# EasyEDA Pro project f4_sys_2025-04-04_13-30-10.eprj

# Schematic Schematic1
Board Name: Board1; Create Date: 2025-04-04; Page Name: P1; Project Name: f4_sys_2025-04-04_13-30-10; Schematic Name: Schematic1; Update Date: 2025-04-20; Company: 嘉立创EDA; Page Size: A4; Version: V1.0
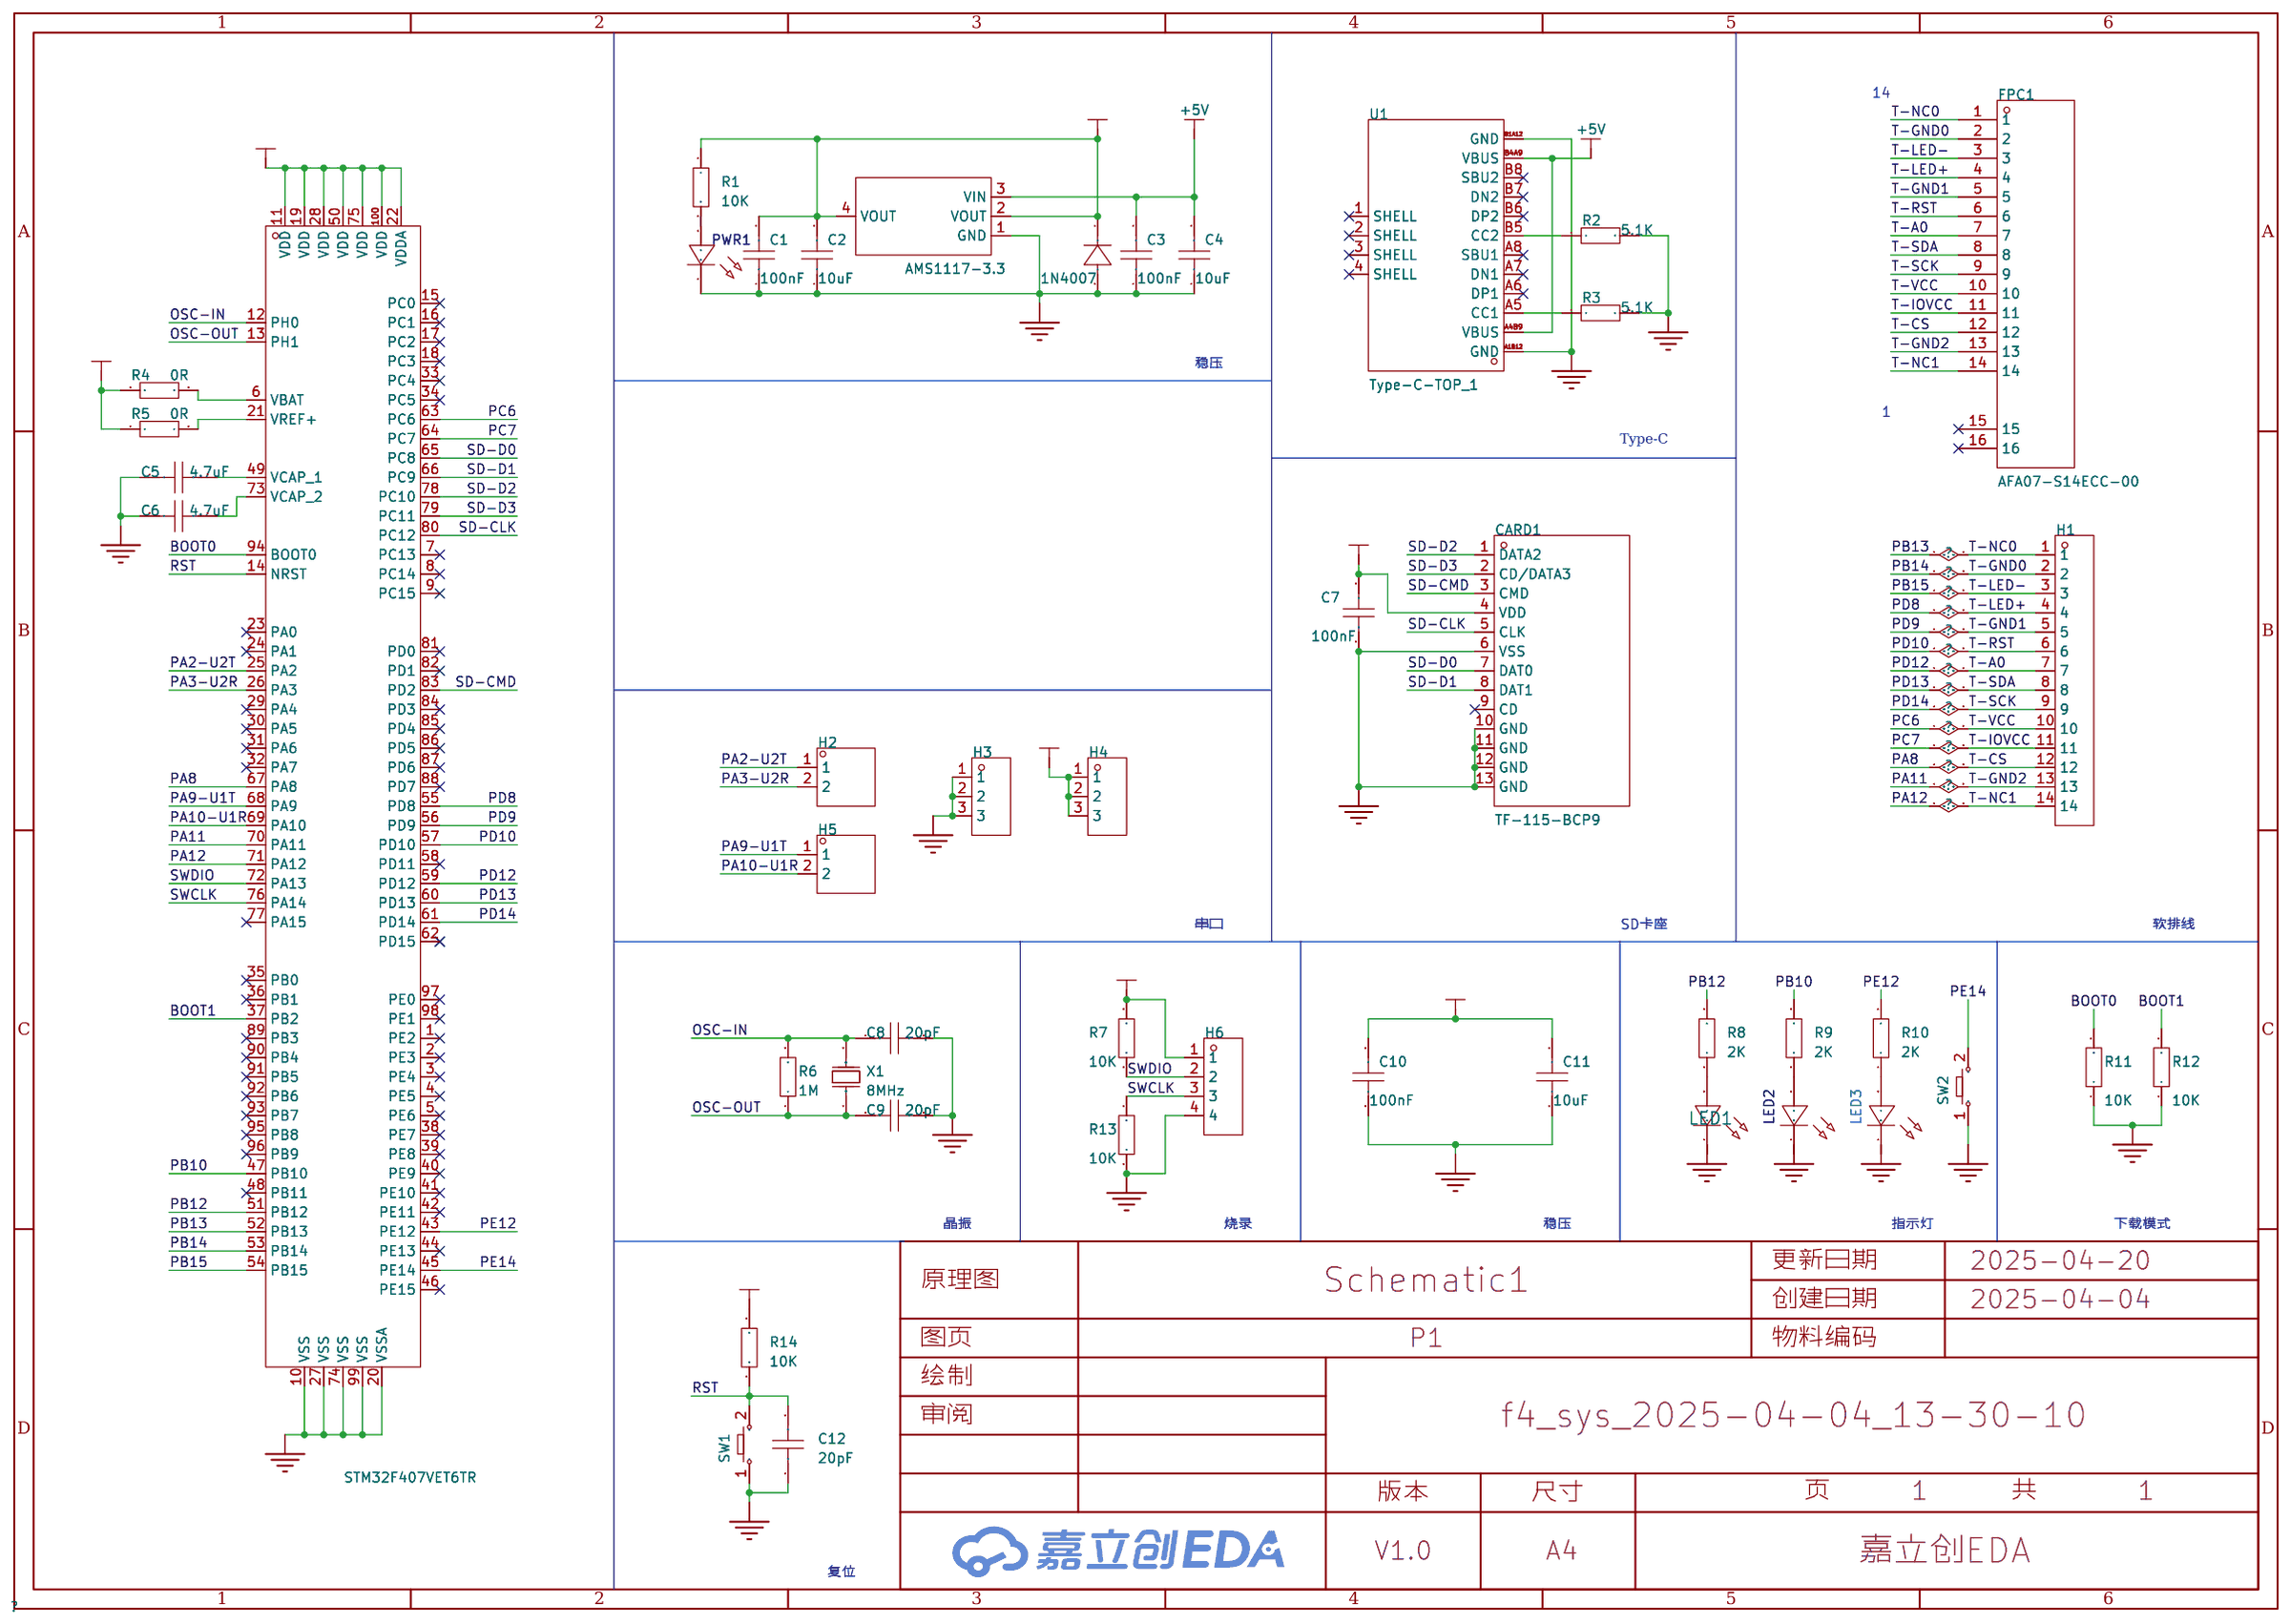
[diagram p0: schematic sheet]

## Parts
C1  100nF  [C0805]
C2  10uF  [C0805]
C3  100nF  [C0805]
C4  10uF  [C0805]
C5  4.7uF  [C0805]
C6  4.7uF  [C0805]
C7  100nF  [C0805]
C8  20pF  [C0805]
C9  20pF  [C0805]
C10  100nF  [C0805]
C11  10uF  [C0805]
C12  20pF  [C0805]
CARD1  TF-115-BCP9  [TF-SMD_TF-115-BCP9]
FPC1  AFA07-S14ECC-00  [FPC-SMD_AFA07-S14ECC-00]
H1  -  [HDR-TH_14P-P2.54-V-M]
H2  -  [HDR-TH_2P-P2.54-V-M-1]
H3  -  [HDR-TH_3P-P2.54-V-M]
H4  -  [HDR-TH_3P-P2.54-V-M]
H5  -  [HDR-TH_2P-P2.54-V-M-1]
H6  -  [HDR-TH_4P-P2.54-V-M]
LED1  -  [LED_0805]
LED2  -  [LED_0805]
LED3  -  [LED_0805]
PWR1  -  [LED_0805]
R1  10K  [R0805]
R2  5.1K  [R0805]
R3  5.1K  [R0805]
R4  0R  [R0805]
R5  0R  [R0805]
R6  1M  [R0805]
R7  10K  [R0805]
R8  2K  [R0805]
R9  2K  [R0805]
R10  2K  [R0805]
R11  10K  [R0805]
R12  10K  [R0805]
R13  10K  [R0805]
R14  10K  [R0805]
SW1  -  [Key_SMD_3x4x2]
SW2  -  [Key_SMD_3x4x2]
U1  Type-C-TOP_1  [USB-C-SMD_TYPE-C16PIN]
U2  AMS1117-3.3  [SOT-223-3_L6.5-W3.4-P2.30-LS7.0-BR]
U3  STM32F407VET6TR  [LQFP-100_L14.0-W14.0-P0.50-LS16.0-BL]
U4  1N4007  [SMA_L4.3-W2.6-LS5.1-RD]
X1  8MHz  [HC-49S_L11.5-W4.8]

## Library data of the parts
C1-C12 = CAP_0805: Supplier Footprint: 0805
CARD1 = TF-115-BCP9: LCSC Part Name: 自弹式 MicroSD卡(TF卡) 卡座; Supplier Part: C720505; Manufacturer: XUNPU(讯普); Supplier Footprint: SMD; JLCPCB Part Class: 扩展库; Datasheet: https://atta.szlcsc.com/upload/public/pdf/source/20210906/DBEC8F03AA1503572333C7CF4A76D0AD.pdf; Supplier: LCSC; Card Connection Mode: 自弹式; Card Type: MicroSD卡(TF卡); Connector Type: 卡座; Maximum Body Height: 1.8mm; Operating Temperature Range: -25℃~+85℃
FPC1 = AFA07-S14ECC-00: LCSC Part Name: 间距:1mm P数:14P 抽屉式 上接; Supplier Part: C262369; Manufacturer: JS(钜硕电子); Supplier Footprint: SMD,P=1mm,卧贴; JLCPCB Part Class: 扩展库; Datasheet: https://atta.szlcsc.com/upload/public/pdf/source/20180810/C262751_01D74A74D4351CFF8B7B7891E98822FA.pdf; Supplier: LCSC; Locking Feature: 抽屉式; Contact Type: 上接; Number of Contacts: 14P; Pitch: 1mm; Mounting Type: 卧贴; FFC, FCB Thickness: 0.3mm; Height Above Board: 2.5mm
H1 = HDR-M_2.54_1x14P: Supplier Part: C2894937; Supplier Footprint: 插件
H2 H5 = HDR-M_2.54_1x2P: Supplier Part: C124375; Supplier Footprint: 插件
H3 H4 = HDR-M_2.54_1x3P: Supplier Part: C2937625; Supplier Footprint: 插件
H6 = HDR-M_2.54_1x4P: Supplier Part: C492403; Supplier Footprint: 插件
LED1 = LED_0805-R: Supplier Footprint: 0805
LED2 PWR1 = LED_0805-G: Supplier Footprint: 0805
LED3 = LED_0805-B: Supplier Footprint: 0805
R1-R14 = Res_0805: Supplier Footprint: 0805
SW1 SW2 = Key_SMD_3x4x2: Supplier Footprint: SMD
U1 = Type-C-TOP_1: Supplier Part: C9900005857; Supplier Footprint: Type-C16P; JLCPCB Part Class: 扩展库; Supplier: LCSC
U2 = AMS1117-3.3_C6186: LCSC Part Name: 输出3.3V 1A; Supplier Part: C6186; Manufacturer: AMS; Supplier Footprint: SOT-223; JLCPCB Part Class: 基础库; Datasheet: https://atta.szlcsc.com/upload/public/pdf/source/20180727/C6186_7A095716F0823C02F1997A905E26C086.pdf; Supplier: LCSC; Output Type: 固定; Output Voltage: 3.3V; Output Current: 1A; Power Supply Rejection Ratio (PSRR): 72dB@(120Hz); Voltage Dropout: 1.3V@(800mA); Features: 过流保护(OCP)；热关断(TSD); Output Configuration: 正极; Number of Outputs: 1
U3 = STM32F407VET6TR: LCSC Part Name: 带DSP和FPU的高性能基础系列ARM Cortex-M4 MCU，具有512 KB Flash、168 MHz CPU、ART加速器、以太网和FSMC; Supplier Part: C5269943; Manufacturer: ST(意法半导体); Supplier Footprint: LQFP-100(14x14); JLCPCB Part Class: 扩展库; Datasheet: https://atta.szlcsc.com/upload/public/pdf/source/20201130/C919362_39400D478C258148B3DF984CE4A4041A.pdf; Supplier: LCSC; CPU Core: ARM-M4; CPU Maximum Speed: 168MHz; Number of I/O: 82; ADC (Bit): 12bit; DAC (Bit): 12bit; Low Voltage Detection Threshold: 1.8V~3.6V
U4 = 1N4007: Supplier Part: C9900004759; JLCPCB Part Class: 扩展库; Supplier: LCSC
X1 = 49SAT080000201060: LCSC Part Name: 8MHz ±10ppm 20pF; Supplier Part: C390758; Manufacturer: JGHC(晶光华); Supplier Footprint: HC-49S-SMD; JLCPCB Part Class: 扩展库; Datasheet: https://atta.szlcsc.com/upload/public/pdf/source/20200102/C479159_77354EAC8C21D1127CB2E163DDA33705.pdf; Supplier: LCSC; Crystal Type: 贴片晶振; Normal temperature Frequency Tolerance: ±10ppm; External load capacitor: 20pF; Operating Temperature: -20℃~+70℃

## Nets
+3.3V: C1.2 C2.2 C7.2 C10.2 C11.2 CARD1.4(VDD) H4.1 H4.2 H4.3 H6.1 R1.1 R4.1 R5.1 R7.2 R14.2 U2.2(VOUT) U2.4(VOUT) U3.11(VDD) U3.19(VDD) U3.22(VDDA) U3.28(VDD) U3.50(VDD) U3.75(VDD) U3.100(VDD) U4.1(K)
+5V: C3.2 C4.2 U1.A4B9(VBUS) U1.B4A9(VBUS) U2.3(VIN)
GND: C1.1 C2.1 C3.1 C4.1 C5.1 C6.1 C7.1 C8.2 C9.2 C10.1 C11.1 C12.1 CARD1.6(VSS) CARD1.10(GND) CARD1.11(GND) CARD1.12(GND) CARD1.13(GND) H3.1 H3.2 H3.3 H6.4 LED1.1(C) LED2.1(C) LED3.1(C) PWR1.1(C) R2.2 R3.2 R11.1 R12.1 R13.1 SW1.1 SW2.1 U1.A1B12(GND) U1.B1A12(GND) U2.1(GND) U3.10(VSS) U3.20(VSSA) U3.27(VSS) U3.74(VSS) U3.99(VSS) U4.2(A)
BOOT0: R11.2 U3.94(BOOT0)
BOOT1: R12.2 U3.37(PB2)
OSC-IN: C8.1 R6.2 U3.12(PH0) X1.2(OSC2)
OSC-OUT: C9.1 R6.1 U3.13(PH1) X1.1(OSC1)
PA2-U2T: H2.1 U3.25(PA2)
PA3-U2R: H2.2 U3.26(PA3)
PA8: FPC1.12 H1.12 U3.67(PA8)
PA9-U1T: H5.1 U3.68(PA9)
PA10-U1R: H5.2 U3.69(PA10)
PA11: FPC1.13 H1.13 U3.70(PA11)
PA12: FPC1.14 H1.14 U3.71(PA12)
PB10: R9.2 U3.47(PB10)
PB12: R8.2 U3.51(PB12)
PB13: FPC1.1 H1.1 U3.52(PB13)
PB14: FPC1.2 H1.2 U3.53(PB14)
PB15: FPC1.3 H1.3 U3.54(PB15)
PC6: FPC1.10 H1.10 U3.63(PC6)
PC7: FPC1.11 H1.11 U3.64(PC7)
PD8: FPC1.4 H1.4 U3.55(PD8)
PD9: FPC1.5 H1.5 U3.56(PD9)
PD10: FPC1.6 H1.6 U3.57(PD10)
PD12: FPC1.7 H1.7 U3.59(PD12)
PD13: FPC1.8 H1.8 U3.60(PD13)
PD14: FPC1.9 H1.9 U3.61(PD14)
PE12: R10.2 U3.43(PE12)
PE14: SW2.2 U3.45(PE14)
RST: C12.2 R14.1 SW1.2 U3.14(NRST)
SD-CLK: CARD1.5(CLK) U3.80(PC12)
SD-CMD: CARD1.3(CMD) U3.83(PD2)
SD-D0: CARD1.7(DAT0) U3.65(PC8)
SD-D1: CARD1.8(DAT1) U3.66(PC9)
SD-D2: CARD1.1(DATA2) U3.78(PC10)
SD-D3: CARD1.2(CD/DATA3) U3.79(PC11)
SWCLK: H6.3 R13.2 U3.76(PA14)
SWDIO: H6.2 R7.1 U3.72(PA13)
$1N2490: C5.2 U3.49(VCAP_1)
$1N2542: C6.2 U3.73(VCAP_2)
$1N5030: PWR1.2(A) R1.2
$1N7226: R2.1 U1.B5(CC2)
$1N7230: R3.1 U1.A5(CC1)
$1N11588: R4.2 U3.6(VBAT)
$1N11629: R5.2 U3.21(VREF+)
Net-(LED1-2): LED1.2(A) R8.1
Net-(LED2-2): LED2.2(A) R9.1
Net-(LED3-2): LED3.2(A) R10.1

Not connected (* = marked no-connect by the designer): CARD1 9(CD)*; FPC1 15* 16*; U1 1(SHELL)* 2(SHELL)* 3(SHELL)* 4(SHELL)* A6(DP1)* A7(DN1)* A8(SBU1)* B6(DP2)* B7(DN2)* B8(SBU2)*; U3 1(PE2)* 2(PE3)* 3(PE4)* 4(PE5)* 5(PE6)* 7(PC13)* 8(PC14)* 9(PC15)* 15(PC0)* 16(PC1)* 17(PC2)* 18(PC3)* 23(PA0)* 24(PA1)* 29(PA4)* 30(PA5)* 31(PA6)* 32(PA7)* 33(PC4)* 34(PC5)* 35(PB0)* 36(PB1)* 38(PE7)* 39(PE8)* 40(PE9)* 41(PE10)* 42(PE11)* 44(PE13)* 46(PE15)* 48(PB11)* 58(PD11)* 62(PD15)* 77(PA15)* 81(PD0)* 82(PD1)* 84(PD3)* 85(PD4)* 86(PD5)* 87(PD6)* 88(PD7)* 89(PB3)* 90(PB4)* 91(PB5)* 92(PB6)* 93(PB7)* 95(PB8)* 96(PB9)* 97(PE0)* 98(PE1)*

## Notes on the sheet
- 14
- 稳压
- 1
- Type-C
- 串口
- SD卡座
- 软排线
- 晶振
- 烧录
- 稳压
- 指示灯
- 下载模式
- 复位

# Board PCB1
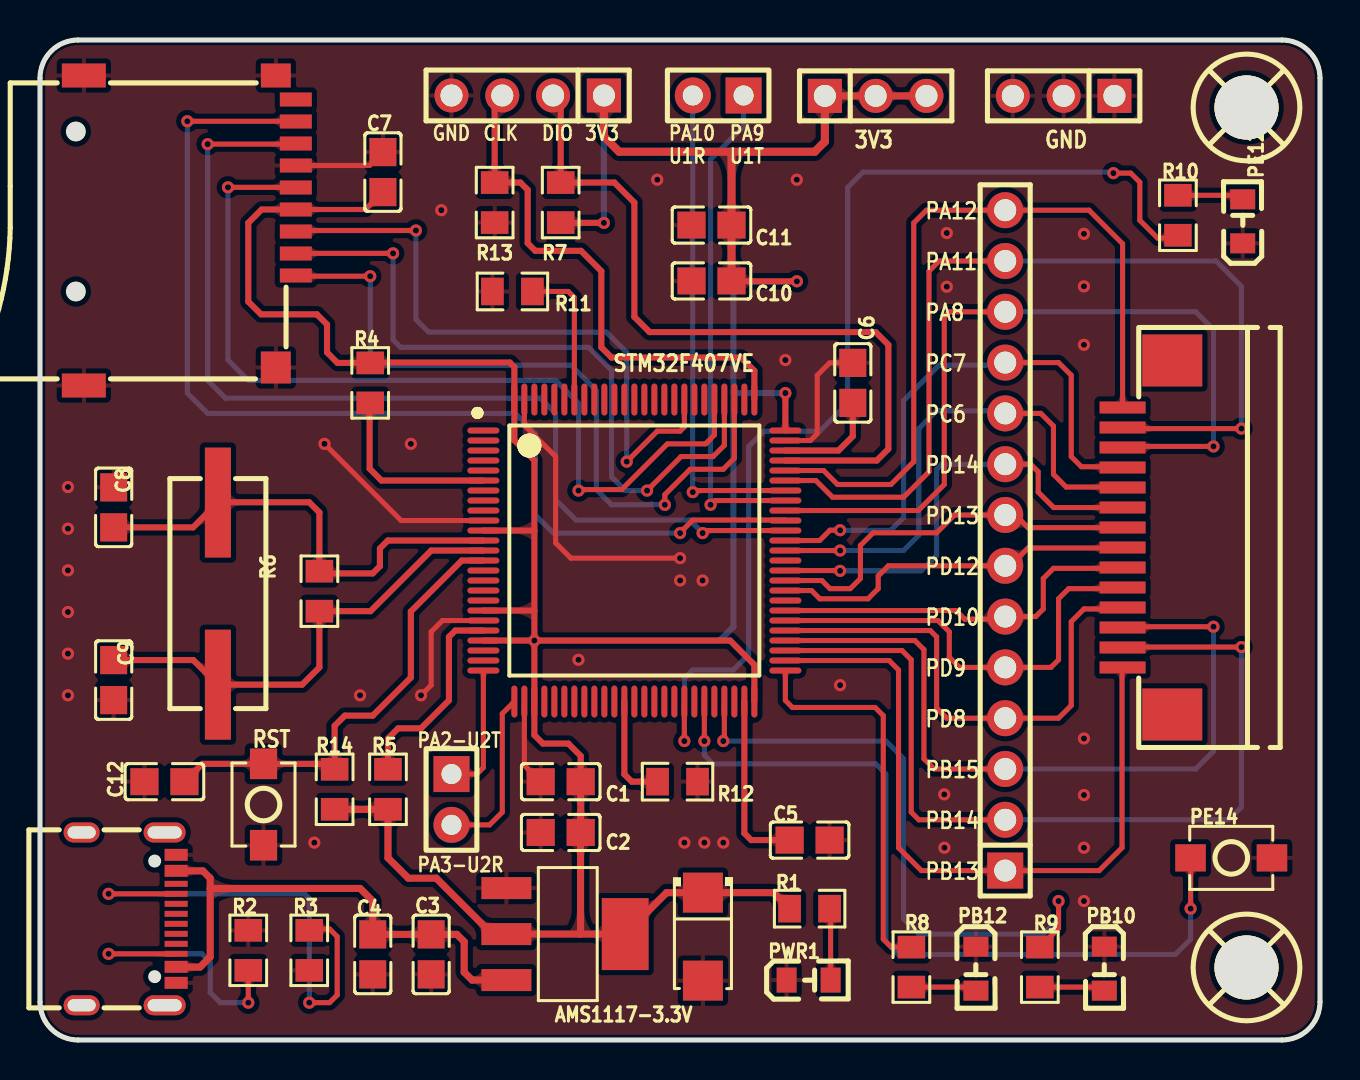
[diagram p1: board, top side]
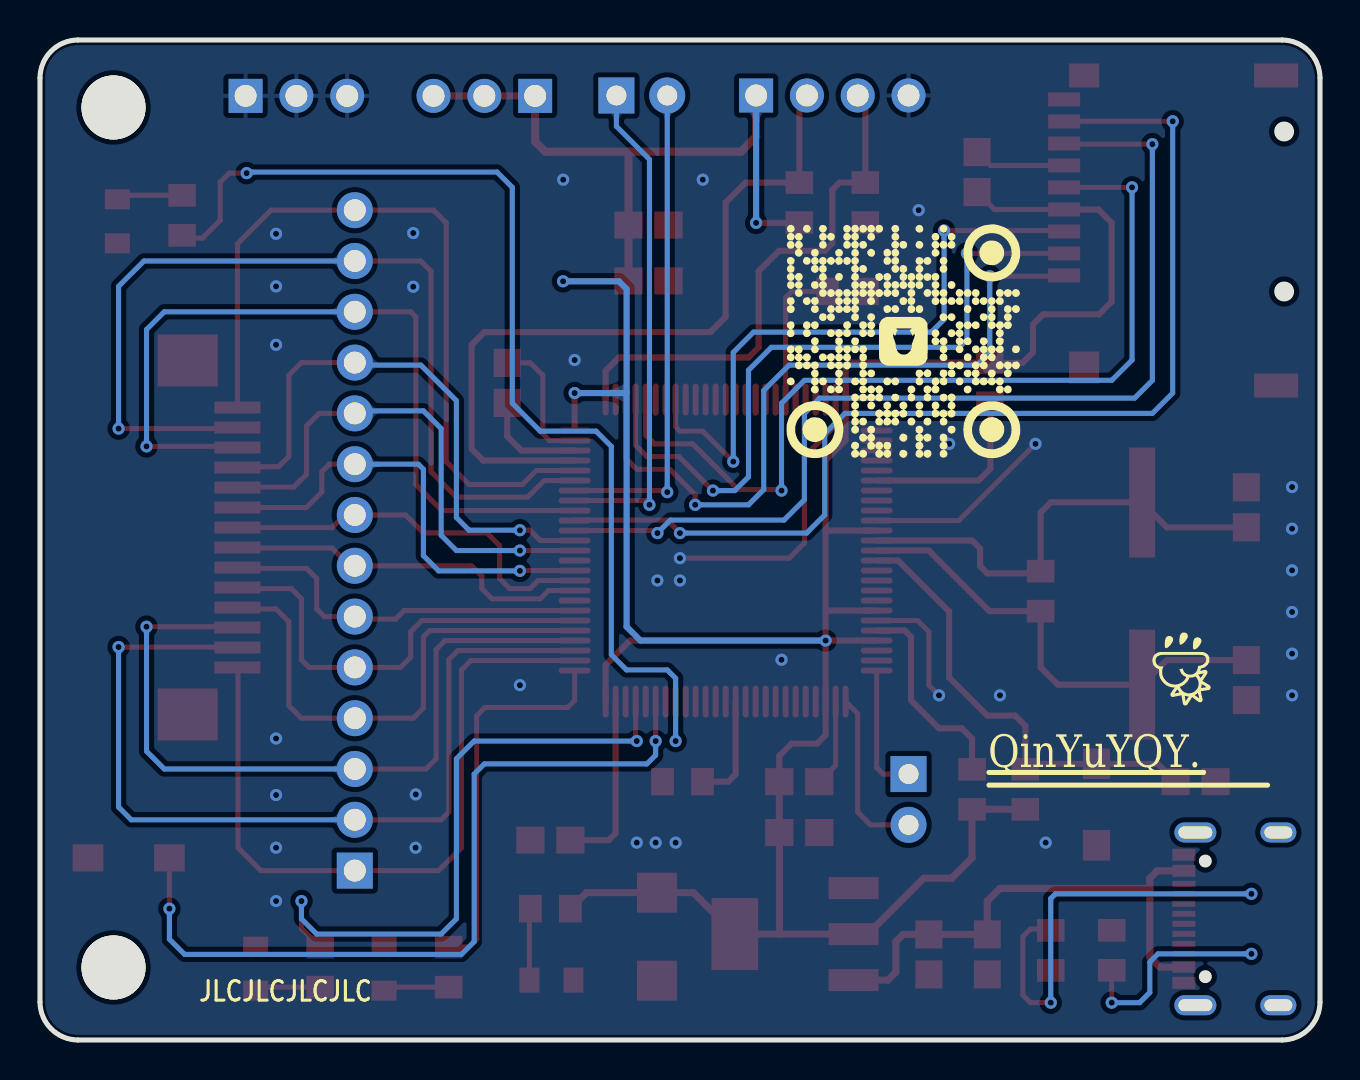
[diagram p2: board, bottom side, seen from below]

Outline 64 x 50 mm; copper layers: Top Layer, Bottom Layer. Coordinates in mm from the lower left corner of the outline.
Outline path: 0,48.1 0,1.91 arc(0.56,0.56) 1.91,0 62.09,0 arc(63.44,0.56) 64,1.91 64,48.1 arc(63.44,49.44) 62.09,50 1.91,50 arc(0.56,49.44) 0,48.1
Stack: Top Layer 0.035mm / Dielectric1 1.51mm FR4 er 4.5 / Bottom Layer 0.035mm

## Design rules (mm)
net OSC-IN: DP1
net OSC-OUT: DP1
template: 自定义配置
spacing copperThickness1oz (default): track to track 0.102, other pairs 0.102 to 0.3
spacing copperThickness2oz: track to track 0.203, other pairs 0.152 to 0.3
track width copperThickness1oz (default): min 0.127, default 0.254, max 2.54
track width copperThickness2oz: min 0.203, default 0.254, max 2.54
differential pair differentialPair (default): width min 0.127, default 0.254, max 2.54; gap min 0.152, default 0.152
via viaSize (default): diameter min 0.5, default 0.61, max 10; hole min 0.3, default 0.305, max 6.299

## Placement (name value [footprint] x y rotation side)
C1  100nF  [C0805]  26.03 12.92 0 top
C2  10uF  [C0805]  26.03 10.38 0 top
C3  100nF  [C0805]  19.56 4.28 90 top
C4  10uF  [C0805]  16.64 4.28 90 top
C5  4.7uF  [C0805]  38.48 10 180 top
C6  4.7uF  [C0805]  40.64 32.86 270 top
C7  100nF  [C0805]  17.15 43.4 270 top
C8  20pF  [C0805]  3.68 26.63 90 top
C9  20pF  [C0805]  3.68 18 270 top
C10  100nF  [C0805]  33.58 40.75 0 top
C11  10uF  [C0805]  33.58 37.95 0 top
C12  20pF  [C0805]  6.22 12.92 0 top
CARD1  TF-115-BCP9  [TF-SMD_TF-115-BCP9]  7.49 40.48 270 top
FPC1  AFA07-S14ECC-00  [FPC-SMD_AFA07-S14ECC-00]  55.37 25.13 90 top
H1  -  [HDR-TH_14P-P2.54-V-M]  48.26 24.98 90 top
H2  -  [HDR-TH_2P-P2.54-V-M-1]  20.57 12.03 270 top
H3  -  [HDR-TH_3P-P2.54-V-M]  51.18 47.21 180 top
H4  -  [HDR-TH_3P-P2.54-V-M]  41.78 47.21 0 top
H5  -  [HDR-TH_2P-P2.54-V-M-1]  33.91 47.23 180 top
H6  -  [HDR-TH_4P-P2.54-V-M]  24.38 47.23 180 top
PB10  -  [LED_0805]  53.21 3.52 270 top
PB12  -  [LED_0805]  46.79 3.52 270 top
PE12  -  [LED_0805]  60.14 40.98 90 top
PE14  -  [Key_SMD_3x4x2]  59.56 9.11 180 top
PWR1  -  [LED_0805]  38.48 2.99 0 top
R1  10K  [R0805]  38.48 6.57 0 top
R2  5.1K  [R0805]  10.41 4.48 90 top
R3  5.1K  [R0805]  13.46 4.48 270 top
R4  0R  [R0805]  16.51 32.86 270 top
R5  0R  [R0805]  17.4 12.54 90 top
R6  1M  [R0805]  13.97 22.44 90 top
R7  10K  [R0805]  26.03 41.87 270 top
R8  2K  [R0805]  43.57 3.65 90 top
R9  2K  [R0805]  49.99 3.65 90 top
R10  2K  [R0805]  56.9 41.24 270 top
R11  10K  [R0805]  23.62 37.43 0 top
R12  10K  [R0805]  31.88 12.92 180 top
R13  10K  [R0805]  22.73 41.87 90 top
R14  10K  [R0805]  14.73 12.54 270 top
SCREW1  -  [M3螺丝]  60.32 46.63 0 top
SCREW1#2  -  [M3螺丝]  60.32 3.63 0 top
SW1  -  [Key_SMD_3x4x2]  11.18 11.77 90 top
U1  Type-C-TOP_1  [USB-C-SMD_TYPE-C16PIN]  4.44 6.06 270 top
U2  AMS1117-3.3  [SOT-223-3_L6.5-W3.4-P2.30-LS7.0-BR]  26.29 5.3 180 top
U3  STM32F407VET6TR  [LQFP-100_L14.0-W14.0-P0.50-LS16.0-BL]  29.72 24.47 270 top
U4  1N4007  [SMA_L4.3-W2.6-LS5.1-RD]  33.15 5.17 270 top
X1  8MHz  [HC-49S_L11.5-W4.8]  8.9 22.32 270 top

## Footprints (pads in the part's own frame, mm; a bottom-side part is the same pattern mirrored in y, then rotated)
C0805
  rect 1.41x1.35 smd: 1(-1,0) 2(1,0)
FPC-SMD_AFA07-S14ECC-00
  rect 0.6x2.3 smd: 1(-6.5,1.242) 2(-5.503,1.242) 3(-4.503,1.242) 4(-3.502,1.242) 5(-2.502,1.242) 6(-1.502,1.242) 7(-0.502,1.242) 8(0.497,1.242) 9(1.498,1.242) 10(2.498,1.242) 11(3.498,1.242) 12(4.497,1.242) 13(5.497,1.242) 14(6.497,1.242)
  rect 2.6x3 smd: 15(-8.85,-1.242) 16(8.85,-1.242)
HC-49S_L11.5-W4.8
  rect 5.5x1.3 smd: 1(4.553,0) 2(-4.553,0)
HDR-TH_2P-P2.54-V-M-1
  rect 1.8x1.8 hole 1: 1(-1.27,0)
  round 1.8 hole 1: 2(1.27,0)
HDR-TH_3P-P2.54-V-M
  rect 1.7x1.7 hole 1.1: 1(-2.54,0)
  round 1.7 hole 1.1: 2(0,0) 3(2.54,0)
HDR-TH_4P-P2.54-V-M
  rect 1.7x1.7 hole 1.1: 1(-3.81,0)
  round 1.7 hole 1.1: 2(-1.27,0) 3(1.27,0) 4(3.81,0)
HDR-TH_14P-P2.54-V-M
  rect 1.8x1.8 hole 1.1: 1(-16.51,0)
  round 1.8 hole 1.1: 2(-13.97,0) 3(-11.43,0) 4(-8.89,0) 5(-6.35,0) 6(-3.81,0) 7(-1.27,0) 8(1.27,0) 9(3.81,0) 10(6.35,0) 11(8.89,0) 12(11.43,0) 13(13.97,0) 14(16.51,0)
Key_SMD_3x4x2
  rect 1.53x1.36 smd: 1(-2.035,0) 2(2.035,0)
LED_0805
  rect 1x1.25 smd: 1(-1.15,0.005) 2(1.05,0.005)
LQFP-100_L14.0-W14.0-P0.50-LS16.0-BL
  oval 0.3x1.6 smd: 1(-6,-7.55) 2(-5.5,-7.55) 3(-5,-7.55) 4(-4.5,-7.55) 5(-4,-7.55) 6(-3.5,-7.55) 7(-3,-7.55) 8(-2.5,-7.55) 9(-2,-7.55) 10(-1.5,-7.55) 11(-1,-7.55) 12(-0.5,-7.55) 13(0,-7.55) 14(0.5,-7.55) 15(1,-7.55) 16(1.5,-7.55) 17(2,-7.55) 18(2.5,-7.55) 19(3,-7.55) 20(3.5,-7.55) 21(4,-7.55) 22(4.5,-7.55) 23(5,-7.55) 24(5.5,-7.55) 25(6,-7.55) 51(6,7.55) 52(5.5,7.55) 53(5,7.55) 54(4.5,7.55) 55(4,7.55) 56(3.5,7.55) 57(3,7.55) 58(2.5,7.55) 59(2,7.55) 60(1.5,7.55) 61(1,7.55) 62(0.5,7.55) 63(0,7.55) 64(-0.5,7.55) 65(-1,7.55) 66(-1.5,7.55) 67(-2,7.55) 68(-2.5,7.55) 69(-3,7.55) 70(-3.5,7.55) 71(-4,7.55) 72(-4.5,7.55) 73(-5,7.55) 74(-5.5,7.55) 75(-6,7.55)
  oval 1.6x0.3 smd: 26(7.55,-6) 27(7.55,-5.5) 28(7.55,-5) 29(7.55,-4.5) 30(7.55,-4) 31(7.55,-3.5) 32(7.55,-3) 33(7.55,-2.5) 34(7.55,-2) 35(7.55,-1.5) 36(7.55,-1) 37(7.55,-0.5) 38(7.55,0) 39(7.55,0.5) 40(7.55,1) 41(7.55,1.5) 42(7.55,2) 43(7.55,2.5) 44(7.55,3) 45(7.55,3.5) 46(7.55,4) 47(7.55,4.5) 48(7.55,5) 49(7.55,5.5) 50(7.55,6) 76(-7.55,6) 77(-7.55,5.5) 78(-7.55,5) 79(-7.55,4.5) 80(-7.55,4) 81(-7.55,3.5) 82(-7.55,3) 83(-7.55,2.5) 84(-7.55,2) 85(-7.55,1.5) 86(-7.55,1) 87(-7.55,0.5) 88(-7.55,0) 89(-7.55,-0.5) 90(-7.55,-1) 91(-7.55,-1.5) 92(-7.55,-2) 93(-7.55,-2.5) 94(-7.55,-3) 95(-7.55,-3.5) 96(-7.55,-4) 97(-7.55,-4.5) 98(-7.55,-5) 99(-7.55,-5.5) 100(-7.55,-6)
M3螺丝
  round 3.2 hole 3.2: 1(0,0)
R0805
  rect 1.133x1.377 smd: 1(-1,0) 2(1,0)
SMA_L4.3-W2.6-LS5.1-RD
  rect 2x2 smd: 1(-2.2,0) 2(2.2,0)
SOT-223-3_L6.5-W3.4-P2.30-LS7.0-BR
  rect 2.5x1.1 smd: 1(2.97,-2.3) 2(2.97,0) 3(2.97,2.3)
  rect 2.34x3.6 smd: 4(-2.97,0)
TF-SMD_TF-115-BCP9
  rect 0.7x1.6 smd: 1(2.25,5.3) 2(1.15,5.3) 3(0.05,5.3) 4(-1.05,5.3) 5(-2.15,5.3) 6(-3.25,5.3) 7(-4.35,5.3) 8(-5.45,5.3) 9(-6.55,5.3)
  rect 1.2x1.5 smd: 10(-7.75,4.3)
  rect 1.2x2.2 smd: 11(-7.75,-5.3) 13(7.75,-5.3)
  rect 1.6x1.5 smd: 12(6.85,4.3)
USB-C-SMD_TYPE-C16PIN
  oval 1x2.1 hole 0.6x1.7: 1(-4.32,1.788) 2(4.32,1.788)
  oval 1x1.8 hole 0.6x1.4: 3(-4.32,-2.362) 4(4.32,-2.362)
  rect 0.6x1.15 smd: A1B12(-3.2,2.362) A4B9(-2.4,2.362) B1A12(3.2,2.362) B4A9(2.4,2.362)
  rect 0.3x1.15 smd: A5(-1.25,2.362) A6(-0.25,2.362) A7(0.25,2.362) A8(1.25,2.362) B5(1.75,2.362) B6(0.75,2.362) B7(-0.75,2.362) B8(-1.75,2.362)

## Nets
As in the schematic, except:
GND: C1.1 C2.1 C3.1 C4.1 C5.1 C6.1 C7.1 C8.2 C9.2 C10.1 C11.1 C12.1 CARD1.6 CARD1.10 CARD1.11 CARD1.12 CARD1.13 H3.1 H3.2 H3.3 H6.4 PB10.1 PB12.1 PE12.1 PE14.1 PWR1.1 R2.2 R3.2 R11.1 R12.1 R13.1 SW1.1 U1.A1B12 U1.B1A12 U2.1 U3.10 U3.20 U3.27 U3.74 U3.99 U4.2
PE14: PE14.2 U3.45
$1N8949: PE12.2 R10.1
$1N8977: PB12.2 R8.1
$1N9027: PB10.2 R9.1

Pads without a net: CARD1 9; FPC1 15 16; SCREW1 1; SCREW1#2 1; U1 1 2 3 4 A6 A7 A8 B6 B7 B8; U3 1 2 3 4 5 7 8 9 15 16 17 18 23 24 29 30 31 32 33 34 35 36 38 39 40 41 42 44 46 48 58 62 77 81 82 84 85 86 87 88 89 90 91 92 93 95 96 97 98

## Via types
v1: diameter 0.61, hole 0.305, Top Layer to Bottom Layer, 69 vias

## Routing (per net, layer and track width the routed paths; a pad name or vN(x,y) marks a point on that pad's centre or on a via; arc(x,y) is an arc through that point)
+3.3V: length 180.4
  Top Layer w0.254: CARD1.4 16.27,41.53 C7.2
  Top Layer w0.305: U3.75 v1(37.27,32.35) ; 24.72,21.45 v1(24.72,19.97) ; 24.72,21.45 24.7,21.47 U3.19 ; 24.72,21.45 24.72,25.47 ; v1(24.72,19.97) U3.28 24.72,15.25 25.15,14.82 26.42,14.82 27.03,14.2 C1.2 ; v1(24.72,19.97) 34.5,19.97 35.72,18.76 U3.50 ; v1(37.85,37.94) 34.59,37.94 C11.2 ; 24.72,25.47 24.71,25.47 U3.11 ; 24.72,25.47 24.72,28.99 23.72,29.99 U3.100 23.72,33.65 23.5,33.87 16.53,33.87 R4.1 14.88,33.86 14.35,34.38 14.35,35.78 13.84,36.28 11.05,36.28 10.41,36.92 10.41,40.86 11.08,41.53 CARD1.4 ; R7.2 26.05,40.86 v1(28.19,40.86) ; U3.22 24.72,19.97
  Top Layer w0.355: 27.03,5.3 U2.4 31.33,7.37 U4.1 36.68,7.37 R1.1 ; 27.03,5.3 27.03,10.37 C2.2 C1.2 ; 27.03,5.3 U2.2 22.61,5.3 19.81,8.09 18.41,8.09 17.4,9.11 R5.1 R14.2 ; 44.32,47.21 H4.2 H4.1
  Top Layer w0.406: H6.1 28.19,45.17 28.96,44.41 34.59,44.41 ; 34.59,44.41 34.58,44.4 C10.2 C11.2 ; 34.59,44.41 38.74,44.41 39.24,44.92 H4.1
  Bottom Layer w0.305: H6.1 v1(28.19,40.86) ; 34.67,32.39 34.67,37.55 35.05,37.94 v1(37.85,37.94) ; 34.67,32.39 34.71,32.35 v1(37.27,32.35) ; 34.67,32.39 34.67,20.66 33.98,19.97 v1(24.72,19.97)
+5V: length 26.3
  Top Layer w0.355: U1.A4B9 8.14,8.46 8.51,8.09 8.51,7.58 ; 6.81,3.66 6.82,3.65 8,3.65 8.51,4.15 8.51,7.58 ; U2.3 21.6,3 21.21,3.39 21.21,4.92 20.84,5.28 C3.2 C4.2 16.64,6.95 16.01,7.58 8.51,7.58
GND: length 45.8
  Top Layer w0.254: U3.99 24.22,30.74 25.78,29.17 25.78,24.85 26.54,24.09 v1(32,24.09) ; CARD1.6 16.47,43.73 C7.1 ; v1(14.22,29.81) 18.06,25.97 U3.10 ; C1.1 24.22,13.73 U3.27 ; U3.20 20.12,20.97 19.56,20.41 19.56,17.74 v1(19.05,17.23) ; U3.74 38.52,29.97 38.86,30.32 38.86,33.24 39.48,33.86 C6.1
  vias: v1(1.4,27.65) v1(1.4,25.57) v1(1.4,23.48) v1(1.4,21.4) v1(1.4,19.32) v1(1.4,17.23) v1(13.72,9.87) v1(16,17.23) v1(18.54,29.81) v1(20.07,41.49) v1(26.92,19.01) v1(30.86,43.02) v1(32,22.98) v1(32.22,9.87) v1(33.13,22.98) v1(33.22,9.87) v1(34.16,9.87) v1(37.27,34) v1(37.84,43.02) v1(40,17.74) v1(45.21,12.28) v1(45.22,9.61) v1(45.34,40.35) v1(45.34,37.66) v1(52.2,40.31) v1(52.2,37.68) v1(52.2,34.76) v1(52.2,15.08) v1(52.2,12.25) v1(52.2,9.61) v1(52.2,6.95)
BOOT0: length 7.3
  Top Layer w0.254: R11.2 26.42,37.43 26.72,37.13 U3.94
BOOT1: length 5.4
  Top Layer w0.305: R12.2 29.59,12.92 29.22,13.29 U3.37
OSC-IN: length 23.4
  Top Layer w0.305: C8.1 7.66,25.63 X1.2 8.91,26.89 13.46,26.89 13.97,26.38 R6.2 14.08,23.33 16.64,23.33 17,23.69 17,24.58 17.39,24.97 U3.12
OSC-OUT: length 23.4
  Top Layer w0.305: U3.13 19.56,24.47 16.53,21.44 R6.1 13.97,18.63 13.1,17.77 X1.1 7.67,19 C9.1
PA2-U2T: length 6.6
  Top Layer w0.254: H2.1 21.84,13.3 22.17,13.62 U3.25
PA3-U2R: length 8.6
  Top Layer w0.254: U3.26 23.11,16.32 23.11,11.39 22.48,10.76 H2.2
PA8: length 41.3
  Top Layer w0.254: H1.12 45.47,36.41 45.21,36.16 45.21,27.78 43.91,26.47 U3.67 ; 54.13,29.75 54.33,29.55 54.46,29.68 v1(58.67,29.68)
  Bottom Layer w0.254: v1(58.67,29.68) 58.67,35.52 57.78,36.41 H1.12
PA9-U1T: length 25
  Top Layer w0.254: v1(33.53,26.76) 33.74,26.97 U3.68
  Bottom Layer w0.254: H5.1 35.18,45.68 33.53,44.03 v1(33.53,26.76)
PA10-U1R: length 24.5
  Top Layer w0.254: v1(32.64,27.39) 32.72,27.47 U3.69
  Bottom Layer w0.254: v1(32.64,27.39) 32.64,47.23
PA11: length 47.5
  Top Layer w0.254: H1.13 44.96,38.95 44.45,38.44 44.45,28.41 43.18,27.14 39.62,27.14 38.79,27.97 U3.70 ; FPC1.13 54.19,30.57 v1(60.07,30.57)
  Bottom Layer w0.254: H1.13 58.8,38.95 60.07,37.68 v1(60.07,30.57)
PA12: length 38.7
  Top Layer w0.254: FPC1.14 54.13,39.81 52.45,41.49 H1.14 44.32,41.49 43.69,40.86 43.69,28.92 42.54,27.78 39.88,27.78 39.18,28.47 U3.71
PB10: length 31.3
  Top Layer w0.254: v1(50.93,6.95) 50.93,5.58 R9.2 ; U3.47 34.22,15 v1(34.16,14.95)
  Bottom Layer w0.254: v1(50.93,6.95) 50.93,6.06 50.16,5.3 43.94,5.3 43.18,6.06 43.18,14.06 42.29,14.95 v1(34.16,14.95)
PB12: length 19.5
  Top Layer w0.254: R8.2 42.56,4.65 42.16,5.04 42.16,16.22 41.75,16.63 37.62,16.63 37.27,16.98 U3.51
PB13: length 35.9
  Top Layer w0.254: U3.52 42.46,18.97 42.93,18.5 42.93,9.61 44.07,8.47 H1.1 52.96,8.47 54.1,9.61 54.1,18.6 FPC1.1
PB14: length 45
  Top Layer w0.254: U3.53 43.1,19.47 43.56,19.01 43.56,11.39 43.94,11.01 H1.2 ; FPC1.2 54.15,19.65 v1(60.07,19.65)
  Bottom Layer w0.254: v1(60.07,19.65) 60.07,11.65 59.44,11.01 H1.2
PB15: length 38.2
  Top Layer w0.254: H1.3 44.7,13.55 44.2,14.06 44.2,19.52 43.74,19.97 U3.54 ; 58.42,20.66 54.17,20.66 FPC1.3
  Bottom Layer w0.254: v1(58.67,20.66) 58.67,14.44 57.78,13.55 H1.3
PC6: length 25.9
  Top Layer w0.254: H1.10 50.04,31.33 50.67,30.7 50.67,28.28 51.31,27.65 54.11,27.65 FPC1.10 ; U3.63 v1(40,24.47)
  Bottom Layer w0.254: H1.10 48.13,31.46 44.83,31.46 43.94,30.57 43.94,25.24 43.18,24.47 v1(40,24.47)
PC7: length 28.5
  Top Layer w0.254: U3.64 38.98,24.97 39.5,25.49 v1(40,25.49) ; FPC1.11 54.09,28.66 52.07,28.66 51.56,29.17 51.56,33.24 50.93,33.87 H1.11
  Bottom Layer w0.254: H1.11 48.13,33.74 44.96,33.74 43.18,31.97 43.18,26.12 42.54,25.49 v1(40,25.49)
PD8: length 25.5
  Top Layer w0.254: FPC1.4 54.06,21.55 52.2,21.55 51.56,20.92 51.56,16.73 50.93,16.09 H1.4 45.34,16.09 44.83,16.6 44.83,20.16 44.51,20.47 U3.55
PD9: length 22
  Top Layer w0.254: FPC1.5 54.07,22.57 51.44,22.57 50.93,22.06 50.93,19.01 50.55,18.63 H1.5 45.97,18.63 45.47,19.14 45.47,20.41 44.9,20.97 U3.56
PD10: length 19
  Top Layer w0.254: U3.57 45.8,21.47 46.23,21.04 48.13,21.04 H1.6 49.78,21.17 50.16,21.55 50.16,23.08 50.67,23.58 54.09,23.58 FPC1.6
PD12: length 18.5
  Top Layer w0.254: FPC1.7 54.1,24.6 49.4,24.6 48.51,23.71 H1.7 42.42,23.71 41.91,23.2 41.91,22.57 41.4,22.06 38.99,22.06 38.58,22.47 U3.59
PD13: length 19.8
  Top Layer w0.254: FPC1.8 54.12,25.62 49.4,25.62 48.77,26.25 H1.8 45.72,26.25 44.83,25.36 41.66,25.36 41.02,24.73 41.02,23.08 40.51,22.57 39.5,22.57 39.09,22.97 U3.60
PD14: length 23.1
  Top Layer w0.254: v1(40,23.46) 39.99,23.47 U3.61 ; H1.9 49.53,28.79 49.91,28.41 49.91,27.39 50.68,26.62 FPC1.9
  Bottom Layer w0.254: v1(40,23.46) 44.07,23.46 44.83,24.22 44.83,28.54 45.09,28.79 H1.9
PE12: length 55.2
  Top Layer w0.254: U3.43 v1(32.22,14.95) ; v1(53.67,43.34) 54.54,43.34 54.99,42.89 54.99,40.98 55.88,40.09 56.75,40.09 R10.2
  Bottom Layer w0.254: v1(32.22,14.95) 32.22,18.08 32.64,18.5 34.67,18.5 35.43,19.27 35.43,29.68 36.19,30.44 38.99,30.44 40.39,31.84 40.39,42.63 41.15,43.4 53.62,43.4 v1(53.67,43.34)
PE14: length 39.9
  Top Layer w0.254: U3.45 v1(33.22,14.95) ; 57.53,8.6 57.53,8.6 v1(57.53,6.57)
  Bottom Layer w0.254: v1(33.22,14.95) 33.22,14.24 33.66,13.81 41.78,13.81 42.29,13.3 42.29,4.92 42.93,4.28 56.77,4.28 57.53,5.04 v1(57.53,6.57)
RST: length 23
  Top Layer w0.305: U3.14 21.09,23.97 18.54,21.43 18.54,18.12 16.64,16.22 15.24,16.22 14.73,15.71 R14.1 14.46,13.81 SW1.2 8.12,13.81 C12.2
SD-CLK: length 44.5
  Top Layer w0.254: U3.80 33.72,30.25 33.27,29.81 31.37,29.81 29.08,27.52 26.92,27.52 ; v1(9.4,42.63) 12.78,42.63 CARD1.5
  Bottom Layer w0.254: 26.92,27.52 26.92,31.84 25.78,32.98 10.41,32.98 9.4,34 v1(9.4,42.63)
  vias: v1(26.92,27.47)
SD-CMD: length 32.1
  Top Layer w0.254: v1(29.34,28.92) 30.86,30.44 32,30.44 32.22,30.66 U3.83 ; v1(18.8,40.48) 12.84,40.48 CARD1.3
  Bottom Layer w0.254: v1(29.34,28.92) 29.34,34.38 28.32,35.4 19.43,35.4 18.8,36.03 v1(18.8,40.48)
SD-D0: length 50.9
  Top Layer w0.254: v1(33.13,25.35) 33.26,25.47 U3.65 ; v1(8.38,44.79) 12.76,44.79 CARD1.7
  Bottom Layer w0.254: v1(33.13,25.35) 32.48,26 26.8,26 25.78,27.01 25.78,31.33 25.02,32.09 9.27,32.09 8.38,32.98 v1(8.38,44.79)
SD-D1: length 54.5
  Top Layer w0.254: CARD1.8 12.78,45.94 v1(7.37,45.94) ; U3.66 37.24,26 32.64,26 32,25.36
  Bottom Layer w0.254: v1(32,25.35) 25.67,25.35 24.76,26.25 24.76,30.32 23.75,31.33 8.38,31.33 7.37,32.35 v1(7.37,45.94)
SD-D2: length 36
  Top Layer w0.254: v1(16.51,38.19) 12.83,38.19 CARD1.1 ; v1(31.24,26.76) 31.24,27.27 32.51,28.54 34.16,28.54 34.72,29.09 U3.78
  Bottom Layer w0.254: v1(16.51,38.19) 16.51,34.38 17.15,33.74 26.54,33.74 27.81,32.47 27.81,27.52 28.57,26.76 v1(31.24,26.76)
SD-D3: length 35.2
  Top Layer w0.254: v1(17.65,39.33) 12.8,39.33 CARD1.2 ; U3.79 34.22,29.74 33.66,29.17 32.06,29.17 v1(30.35,27.47)
  Bottom Layer w0.254: v1(30.35,27.47) 29.26,27.47 28.57,28.16 28.57,33.49 27.43,34.63 18.03,34.63 17.65,35.01 v1(17.65,39.33)
SWCLK: length 26.6
  Top Layer w0.305: U3.76 35.72,33.46 35.05,34.13 28.57,34.13 28.07,34.63 28.07,38.44 27.05,39.46 24.76,39.46 24.38,39.84 24.38,42.51 24.02,42.87 R13.2 22.73,46.85 H6.3
SWDIO: length 38.2
  Top Layer w0.305: U3.72 41.84,28.97 42.42,29.55 42.42,34.76 41.78,35.4 30.48,35.4 29.72,36.16 29.72,41.87 28.72,42.87 R7.1 26.03,46.85 H6.2
$1N2490: length 9
  Top Layer w0.305: C5.2 35.56,10 35.22,10.34 U3.49
$1N2542: length 5.3
  Top Layer w0.305: U3.73 39.93,29.47 40.64,30.19 C6.2
$1N5030: length 3.6
  Top Layer w0.254: R1.2 39.53,6.52 PWR1.2
$1N7226: length 13.9
  Top Layer w0.254: U1.B5 v1(3.43,4.31) ; v1(10.41,1.87) R2.1
  Bottom Layer w0.254: v1(10.41,1.87) 9.02,1.87 8.51,2.38 8.51,3.9 8.1,4.31 v1(3.43,4.31)
$1N7230: length 24.8
  Top Layer w0.254: U1.A5 v1(3.43,7.31) ; R3.1 13.53,5.55 14.48,5.55 14.86,5.17 14.86,2.25 14.48,1.87 v1(13.46,1.87)
  Bottom Layer w0.254: v1(3.43,7.31) 13.23,7.31 13.46,7.07 v1(13.46,1.87)
$1N8949: length 3.3
  Top Layer w0.254: PE12.2 59.93,42.24 R10.1
$1N8977: length 3.3
  Top Layer w0.254: 46.8,2.47 46.62,2.65 R8.1
$1N9027: length 3.3
  Top Layer w0.254: R9.1 53.04,2.65 53.22,2.47
$1N11588: length 9.2
  Top Layer w0.305: R4.2 16.48,31.83 16.48,28.57 17.07,27.97 U3.6
$1N11629: length 10.4
  Top Layer w0.305: U3.21 20.76,20.47 20.45,20.16 20.45,16.98 19.05,15.58 17.91,15.58 17.4,15.08 R5.2

## Copper pours and planes (outline as drawn; the poured copper is in the pictures)
GND on Top Layer: 0,50.13 64.01,50.13 64.01,-0.04 0,-0.04
GND on Bottom Layer: 0,50.13 64.01,50.13 64.01,-0.04 0,-0.04

Small or netless copper shapes (teardrops, artwork), in the pictures only: 203 on Top Layer, 46 on Bottom Layer

## Text on the board
Bottom Silkscreen Layer: JLCJLCJLCJLC | QinYuYQY.
Top Silkscreen Layer: PA2-U2T | PA3-U2R | GND | CLK | DIO | 3V3 | PA10 / U1R | PA9 / U1T | AMS1117-3.3V | PA12 | PA11 | PA8 | PC7 | PC6 | PD14 | PD13 | PD12 | PD10 | PD9 | PD8 | PB15 | PB14 | PB13 | RST | STM32F407VE
